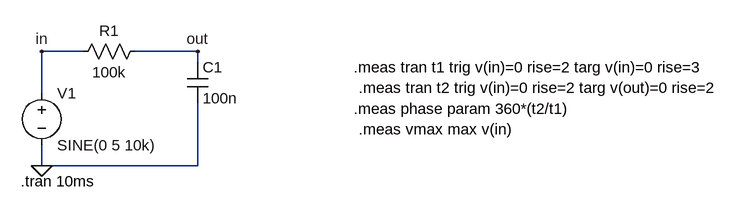
[diagram p0: schematic Draft2.asc]
Draft2.asc, the LTspice schematic file:
Version 4
SHEET 1 1020 680
WIRE -48 -16 -112 -16
WIRE 128 -16 32 -16
WIRE 128 0 128 -16
WIRE -112 48 -112 -16
WIRE -112 160 -112 128
WIRE 128 160 128 64
WIRE 128 160 -112 160
FLAG -112 160 0
FLAG -112 -16 in
FLAG 128 -16 out
SYMBOL cap 112 0 R0
SYMATTR InstName C1
SYMATTR Value 100n
SYMBOL res -64 0 R270
WINDOW 0 32 56 VTop 2
WINDOW 3 0 56 VBottom 2
SYMATTR InstName R1
SYMATTR Value 100k
SYMBOL voltage -112 32 R0
WINDOW 123 0 0 Left 0
WINDOW 39 0 0 Left 0
SYMATTR InstName V1
SYMATTR Value SINE(0 5 10k)
TEXT -144 184 Left 2 !.tran 10ms
TEXT 368 8 Left 2 !.meas tran t1 trig v(in)=0 rise=2 targ v(in)=0 rise=3
TEXT 368 72 Left 2 !.meas phase param 360*(t2/t1)
TEXT 376 104 Left 2 !.meas vmax max v(in)
TEXT 376 40 Left 2 !.meas tran t2 trig v(in)=0 rise=2 targ v(out)=0 rise=2

The netlist it stands for:
* Draft2.asc
C1 out 0 100n
R1 in out 100k
V1 in 0 SINE(0 5 10k)
.tran 10ms
.meas tran t1 trig v(in)=0 rise=2 targ v(in)=0 rise=3
.meas phase param 360*(t2/t1)
.meas vmax max v(in)
.meas tran t2 trig v(in)=0 rise=2 targ v(out)=0 rise=2
.backanno
.end